# EAGLE design optoshield-low1 (EAGLE 6.6.0)
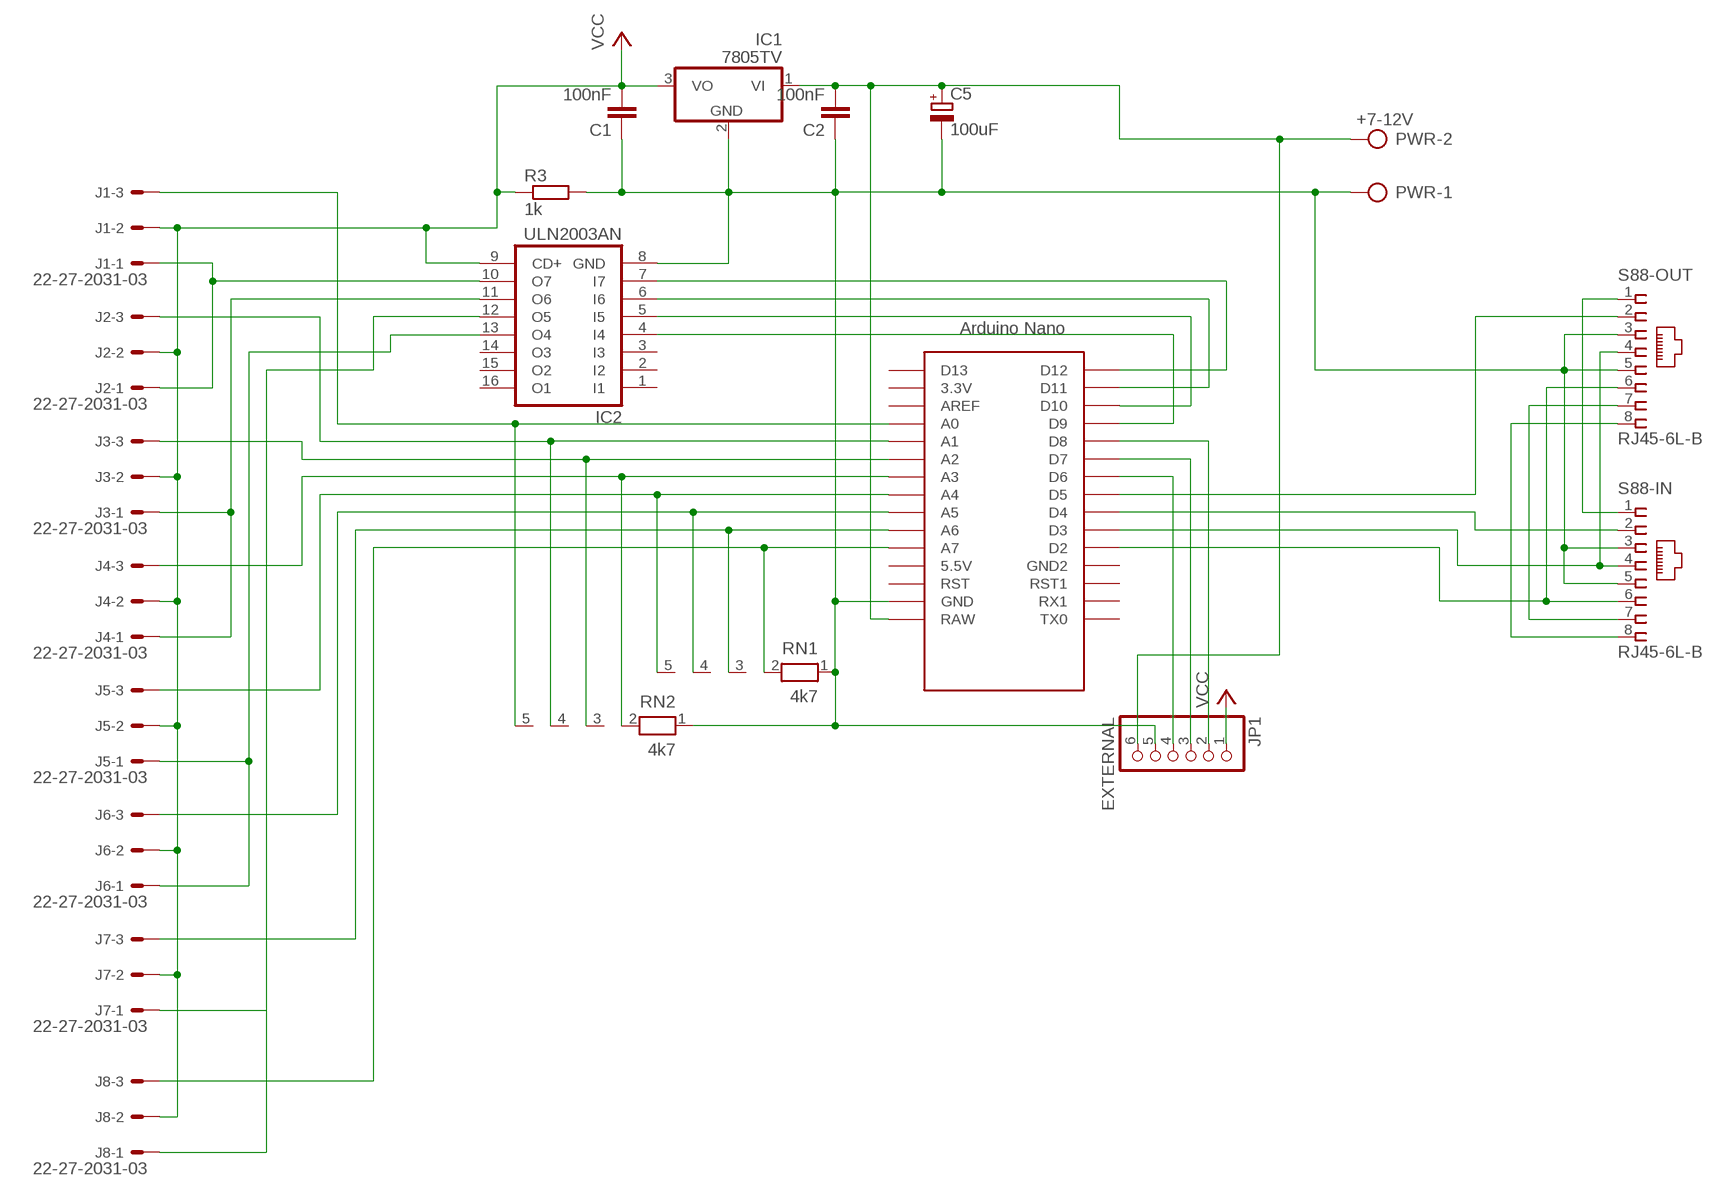
[diagram p0: schematic, sheet 1]

## Parts
C1  100nF  C-EU025-025X050  [C025-025X050]
C2  100nF  C-EU025-025X050  [C025-025X050]
C5  100uF  CPOL-EUE3.5-10  [E3,5-10]
IC1  7805TV  [TO220V]
IC2  ULN2003AN  [DIL16]
J1  22-27-2031-03  [6410-03]
J2  22-27-2031-03  [6410-03]
J3  22-27-2031-03  [6410-03]
J4  22-27-2031-03  [6410-03]
J5  22-27-2031-03  [6410-03]
J6  22-27-2031-03  [6410-03]
J7  22-27-2031-03  [6410-03]
J8  22-27-2031-03  [6410-03]
JP1  EXTERNAL  PINHD-1X6  [1X06]
PWR  +7-12V  AK500/2  [AK500/2]
R3  1k  R-EU_0207/10  [0207/10]
RN1  4k7  RN04  [RN-5]
RN2  4k7  RN04  [RN-5]
S88-IN  RJ45-6L-B  [RJ45-NO-SHIELD]
S88-OUT  RJ45-6L-B  [RJ45-NO-SHIELD]
U$1  NANO  [NANO]

## Nets
GND: C1.1 C2.1 C5.- IC1.2(GND) IC2.8(GND) JP1.5 PWR.1 R3.2 RN1.1 RN2.1 S88-IN.3 S88-IN.5 S88-OUT.3 S88-OUT.5 U$1.GND
N$1: C2.2 C5.+ IC1.1(VI) JP1.6 PWR.2 U$1.RAW
N$2: S88-IN.1 S88-OUT.1
N$3: JP1.2 U$1.D8
N$5: J1.3 RN2.5 U$1.A0
N$6: J4.3 RN2.2 U$1.A3
N$7: J5.3 RN1.5 U$1.A4
N$8: J2.3 RN2.4 U$1.A1
N$9: J3.3 RN2.3 U$1.A2
N$10: J6.3 RN1.4 U$1.A5
N$11: J7.3 RN1.3 U$1.A6
N$12: J8.3 RN1.2 U$1.A7
N$13: JP1.3 U$1.D7
N$14: S88-IN.8 S88-OUT.8
N$15: S88-IN.6 S88-OUT.6 U$1.D2
N$16: IC2.7(I7) U$1.D12
N$17: S88-IN.7 S88-OUT.7
N$18: S88-IN.4 S88-OUT.4 U$1.D3
N$19: S88-IN.2 U$1.D4
N$20: IC2.12(O5) J7.1 J8.1
N$21: S88-OUT.2 U$1.D5
N$23: IC2.6(I6) U$1.D11
N$24: IC2.5(I5) U$1.D10
N$25: IC2.4(I4) U$1.D9
N$26: JP1.4 U$1.D6
N$29: IC2.10(O7) J1.1 J2.1
N$30: IC2.11(O6) J3.1 J4.1
N$32: IC2.13(O4) J5.1 J6.1
VCC: C1.2 IC1.3(VO) IC2.9(CD+) J1.2 J2.2 J3.2 J4.2 J5.2 J6.2 J7.2 J8.2 JP1.1 R3.1
Unconnected: IC2.1(I1) IC2.2(I2) IC2.3(I3) IC2.14(O3) IC2.15(O2) IC2.16(O1) U$1.3.3V U$1.5V(5.5V) U$1.AREF U$1.D13 U$1.GND1(GND2) U$1.ICSP1 U$1.ICSP2 U$1.ICSP3 U$1.ICSP4 U$1.ICSP5 U$1.ICSP6 U$1.RST U$1.RST1 U$1.RX1 U$1.TX0

## Library data of the parts
C1 C2 = rcl:C-EU: CAPACITOR, European symbol
C5 = resistor:CPOL-EU: POLARIZED CAPACITOR, European symbol
IC1 = linear:78*: Positive VOLTAGE REGULATOR Source: http://cache.national.com/ds/LM/LM78L05.pdf http://www.fairchildsemi.com/ds/LM/LM7805.pdf
IC2 = uln-udn:ULN2003A: DRIVER ARRAY
J1-J8 = con-molex:22-?-03: CONNECTOR wire to board 2.54 mm (.1 inch) pitch header; OC_FARNELL: unknown; OC_NEWARK: unknown
JP1 = pinhead:PINHD-1X6: PIN HEADER
PWR = con-ptr500:AK500/2: CONNECTOR; OC_FARNELL: unknown; OC_NEWARK: unknown
R3 = resistor:R-EU_: RESISTOR, European symbol
RN1 RN2 = resistor-net:RN04: RESISTOR NETWORK; OC_FARNELL: unknown; OC_NEWARK: unknown
S88-IN S88-OUT = con-tycoelectronics:RJ45: CORCOM Modular RJ Jacks No Shield Source: www.tycoelectronics.com .. ENG_DS_1654001_1099_RJ_L_0507.pdf; MPN: RJ45-6L-B; OC_FARNELL: unknown; OC_NEWARK: 16R6090
U$1 = Arduino-clone:NANO: Arduino Nano

## Board
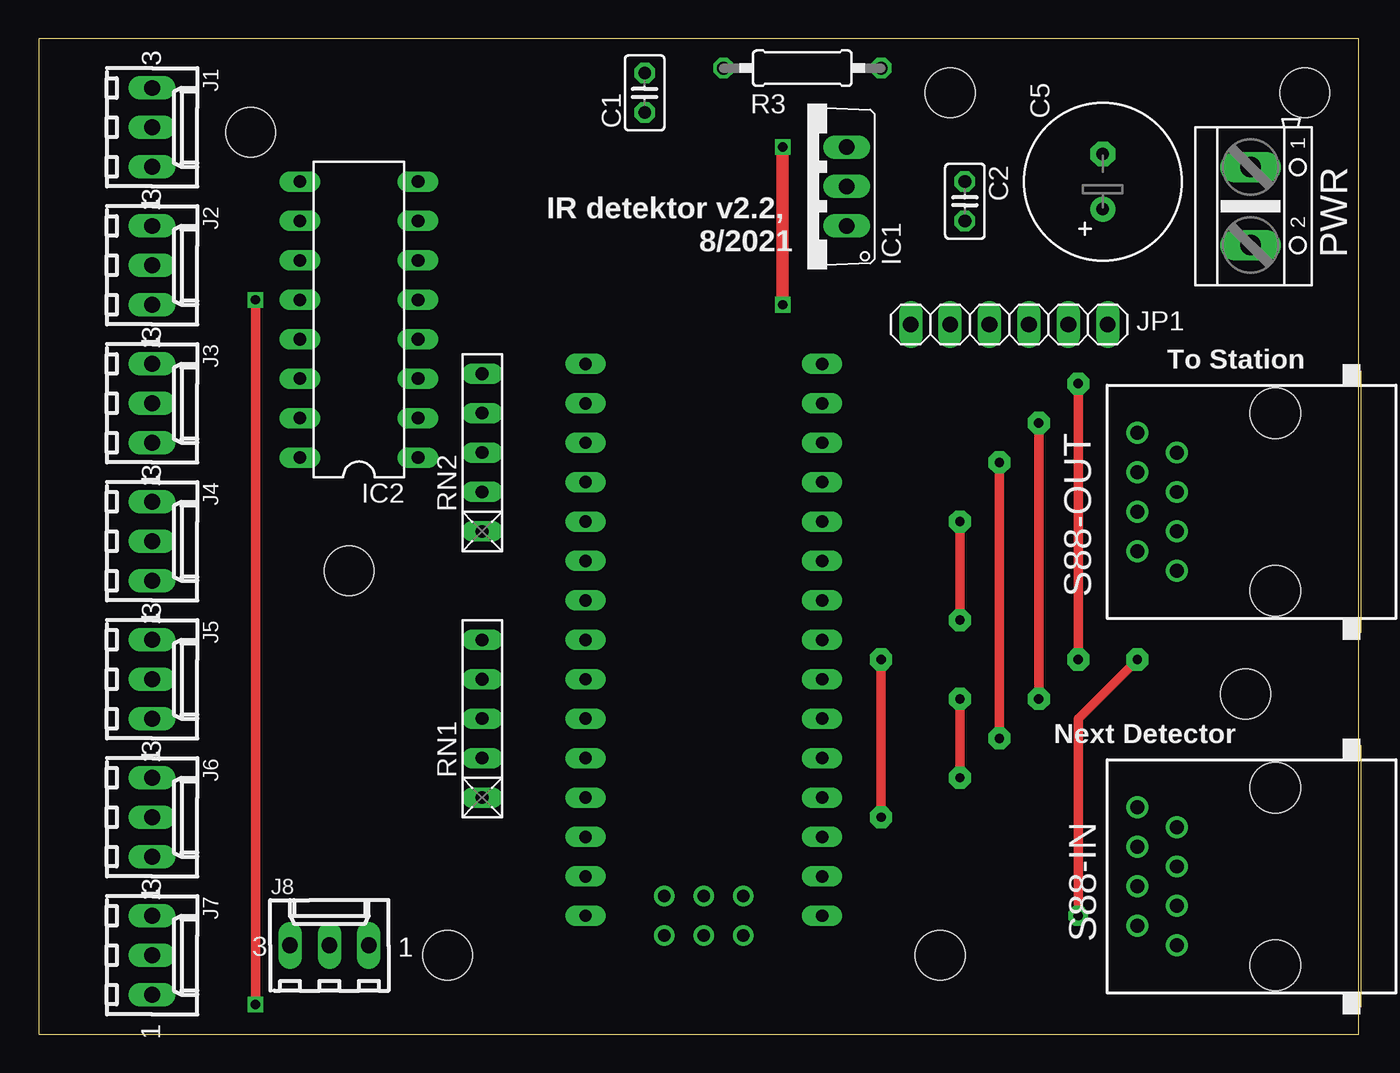
[diagram p1: board, top side]
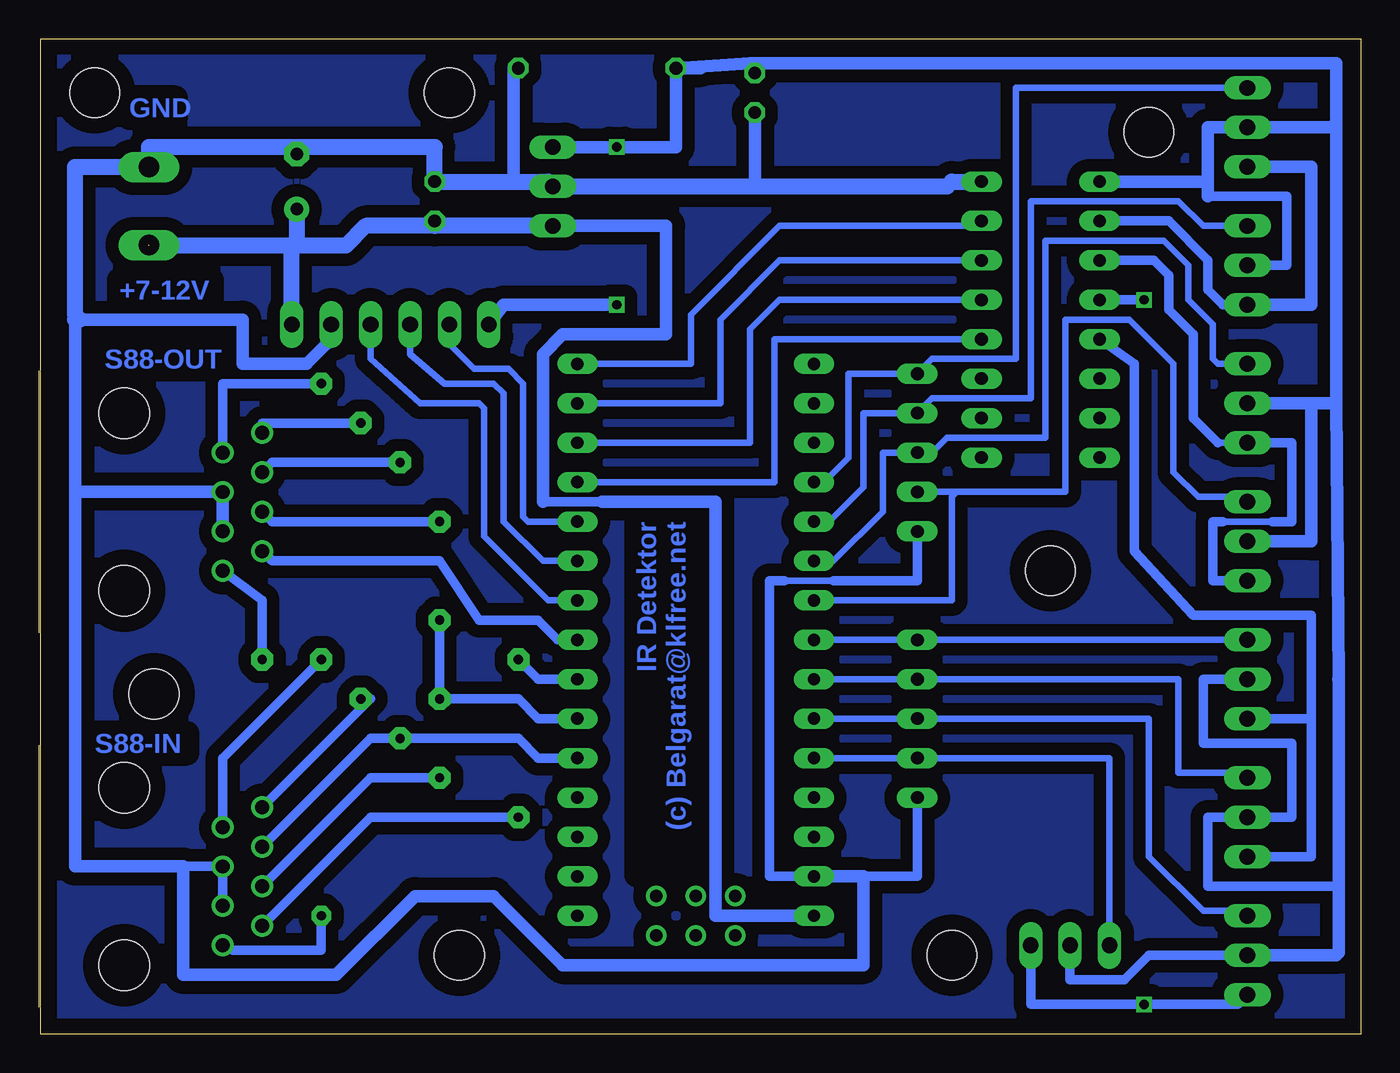
[diagram p2: board, bottom side, seen from below]

Size 85.08 x 64.12 mm. Coordinates in mm from the lower left corner, seen from the top.
Outline: 0,0 85.08,0 85.08,64.12 0,64.12 0,0
Copper layers (1*16): Top 0.035mm / dielectric 1.5mm / Bottom 0.035mm
Design rules "default *": minimum track width 10mil, minimum drill 0.6mm, track to track 8mil, track to pad 8mil, pad to pad 8mil, via to via 8mil, smd to smd 8mil, copper to edge 40mil, drill to drill 8mil, minimum pad ring 10mil, minimum via ring 8mil, stop-mask expansion 4mil, vias tented up to drill 0mil, thermal gap 10mil
Holes 3.2 mm at 77.79,21.91 81.6,60.64 58.1,5.08 58.74,60.64 13.65,58.1 26.35,5.08 20,29.84

### Footprints (pad centres in the part's own frame; a part is rotated, then mirrored left to right if it is on the bottom)
C025-025X050 = drill 0.813 octagon: 1 -1.27,0; 2 1.27,0
E3,5-10 = drill 0.813 pad 1.6: + -1.778,0 | drill 0.813 pad 1.6 octagon: - 1.778,0
TO220V = drill 1.016 long: 1 -2.54,-2.54; 2 0,-2.54; 3 2.54,-2.54
DIL16 = drill 0.813 long: 1 -8.89,-3.81; 2 -6.35,-3.81; 3 -3.81,-3.81; 4 -1.27,-3.81; 5 1.27,-3.81; 6 3.81,-3.81; 7 6.35,-3.81; 8 8.89,-3.81; 9 8.89,3.81; 10 6.35,3.81; 11 3.81,3.81; 12 1.27,3.81; 13 -1.27,3.81; 14 -3.81,3.81; 15 -6.35,3.81; 16 -8.89,3.81
6410-03 = drill 1.016 long: 1 2.54,0; 2 0,0; 3 -2.54,0
1X06 = drill 1.016 long: 1 -6.35,0; 2 -3.81,0; 3 -1.27,0; 4 1.27,0; 5 3.81,0; 6 6.35,0
AK500/2 = drill 1.321 long: 1 -2.515,0; 2 2.515,0
0207/10 = drill 0.813 octagon: 1 -5.08,0; 2 5.08,0
RN-5 = drill 0.813 long: 1 -5.08,0; 2 -2.54,0; 3 0,0; 4 2.54,0; 5 5.08,0
RJ45-NO-SHIELD = drill 0.9 pad 1.4: 1 -4.445,6.35; 2 -3.175,8.89; 3 -1.905,6.35; 4 -0.635,8.89; 5 0.635,6.35; 6 1.905,8.89; 7 3.175,6.35; 8 4.445,8.89 | hole 3.251: -5.715,0; 5.715,0
NANO = drill 0.8 long: 3.3V -10.16,24.13; 5V -10.16,-1.27; A0 -10.16,19.05; A1 -10.16,16.51; A2 -10.16,13.97; A3 -10.16,11.43; A4 -10.16,8.89; A5 -10.16,6.35; A6 -10.16,3.81; A7 -10.16,1.27; AREF -10.16,21.59; D2 5.08,1.27; D3 5.08,3.81; D4 5.08,6.35; D5 5.08,8.89; D6 5.08,11.43; D7 5.08,13.97; D8 5.08,16.51; D9 5.08,19.05; D10 5.08,21.59; D11 5.08,24.13; D12 5.08,26.67; D13 -10.16,26.67; GND -10.16,-6.35; GND1 5.08,-1.27; RAW -10.16,-8.89; RST -10.16,-3.81; RST1 5.08,-3.81; RX1 5.08,-6.35; TX0 5.08,-8.89 | drill 0.8: ICSP1 -5.08,-10.16; ICSP2 -5.08,-7.62; ICSP3 -2.54,-10.16; ICSP4 -2.54,-7.62; ICSP5 0,-10.16; ICSP6 0,-7.62

### Placement (x,y rotation side)
C1  39.05,60.64 90 top
C2  59.69,53.66 270 top
C5  68.58,54.93 90 top
IC1  49.53,54.61 90 top
IC2  20.64,46.04 90 top
J1  7.3,58.42 270 top
J2  7.3,49.53 270 top
J3  7.3,40.64 270 top
J4  7.3,31.75 270 top
J5  7.3,22.86 270 top
J6  7.3,13.97 270 top
J7  7.3,5.08 270 top
J8  18.73,5.71 0 top
JP1  62.55,45.72 0 top
PWR  78.1,53.34 270 top
R3  49.21,62.23 0 top
RN1  28.57,20.32 90 top
RN2  28.57,37.46 90 top
S88-IN  79.69,10.16 90 top
S88-OUT  79.69,34.29 90 top
U$1  45.4,16.51 0 top

### Tracks (layer width: path | path; a pad name or v marks a point on that pad's centre or on a via)
GND
  Bottom 0.406: 37.15,29.21 33.97,29.21
  Bottom 0.61: S88-IN.3 S88-IN.5 75.88,10.79 | RN1.1 28.58,10.16 32.07,10.16 | U$1.GND 38.1,10.16 38.1,29.21 37.15,29.21 | 33.97,29.21 28.58,29.21 RN2.1 | 82.87,46.04 82.87,46.35
  Bottom 0.813: U$1.GND 32.07,10.16 32.07,4.45 51.43,4.45 55.88,8.89 60.96,8.89 66.04,3.81 75.88,3.81 75.88,10.79 82.87,10.79 82.87,34.92 | C1.1 39.05,54.93 38.73,54.61 | R3.2 54.61,62.23 54.61,54.93 | 82.87,34.92 82.87,45.72 82.55,46.04 72.07,46.04 72.07,43.18 67.94,43.18 66.67,44.45 JP1.5 | 82.87,34.92 S88-OUT.5 S88-OUT.3
  Bottom 1.016: 68.58,57.15 59.69,57.15 C2.1 54.61,54.93 52.39,54.93 IC1.2 38.73,54.61 26.67,54.61 26.35,54.93 IC2.8 | 68.58,57.15 78.11,57.15 78.11,55.88 | 82.87,46.35 82.87,55.88 78.11,55.88 | 78.11,55.88 PWR.1 | C5.- 68.58,57.15 | 82.55,46.04 82.87,46.04
N16
  pour Bottom (isolate 0.813): 0.63,63.5 84.14,63.5 83.82,0.64 0.32,0.64
N$1  (1 unrouted)
  Bottom 0.61: 48.9,34.29 52.39,34.29 52.7,34.61
  Bottom 0.813: U$1.RAW 41.59,7.62 41.59,34.29 48.9,34.29 | 52.7,34.29 52.7,34.61 52.7,43.81 51.43,45.09 44.77,45.09 44.77,52.07 IC1.1
  Bottom 1.016: 68.58,50.8 65.4,50.8 64.14,52.07 59.69,52.07 | 68.58,50.8 69.22,50.8 | 69.22,50.8 78.08,50.8 | C5.+ 68.58,50.8 | IC1.1 59.69,52.07 | C2.2 59.69,52.07 | JP1.6 68.9,50.48 69.22,50.8
N$2  (via drill 0.6 pad 1.27, 0.6 pad 1.42)
  Top 0.61: v70.8,24.13 66.99,20.32 v66.99,7.62
  Bottom 0.61: S88-IN.1 72.71,5.4 66.99,5.4 v66.99,7.62 | S88-OUT.1 70.8,27.94 v70.8,24.13
N$3
  Bottom 0.406: U$1.D8 53.66,33.02 53.97,33.34 53.97,41.91 54.93,42.86 57.15,42.86 58.74,44.45 JP1.2
N$5
  Bottom 0.406: J1.3 22.22,60.96 22.22,43.5 27.62,43.5 RN2.5 33.02,42.55 33.02,37.15 34.61,35.56 U$1.A0
N$6
  Bottom 0.406: RN2.2 26.04,34.92 | 26.04,34.92 19.05,34.92 19.05,46.04 14.92,46.04 12.06,43.18 12.06,36.2 10.48,34.61 7.62,34.61 J4.3 | U$1.A3 26.35,27.94 26.35,34.61 26.04,34.92
N$7
  Bottom 0.406: J5.3 RN1.5 U$1.A4
N$8
  Bottom 0.406: J2.3 10.16,52.07 11.75,53.66 21.27,53.66 21.27,40.96 27.62,40.96 RN2.4 32.07,40 32.07,35.24 34.29,33.02 U$1.A1
N$9
  Bottom 0.406: J3.3 9.21,43.18 9.52,43.5 9.52,45.72 11.11,47.31 11.11,49.53 12.7,51.12 20.32,51.12 20.32,38.42 26.67,38.42 27.62,37.46 RN2.3 30.8,37.46 30.8,33.66 33.97,30.48 U$1.A2
N$10
  Bottom 0.406: J6.3 7.62,16.83 11.75,16.83 11.75,22.86 RN1.4 U$1.A5
N$11
  Bottom 0.406: J7.3 7.62,7.94 10.16,7.94 13.65,11.43 13.65,20.32 RN1.3 U$1.A6
N$12
  Bottom 0.406: J8.3 16.19,17.78 RN1.2 U$1.A7
N$13
  Bottom 0.406: JP1.3 61.28,43.81 59.05,41.91 55.88,41.91 55.24,41.27 55.24,33.02 52.7,30.48 U$1.D7
N$14  (via drill 0.6 pad 1.42)
  Top 0.61: v64.45,39.37 v64.45,21.59
  Bottom 0.61: S88-IN.8 63.82,21.59 v64.45,21.59 | v64.45,39.37 70.8,39.37 S88-OUT.8
N$15  (via drill 0.6 pad 1.42)
  Top 0.61: v61.91,19.05 v61.91,36.83
  Bottom 0.61: S88-IN.6 63.82,19.05 v61.91,19.05 54.29,19.05 53.02,17.78 U$1.D2 | S88-OUT.6 70.17,36.83 v61.91,36.83
N$16
  Bottom 0.406: U$1.D12 43.18,43.18 43.18,46.35 37.47,52.07 25.4,52.07 25.08,52.39 IC2.7
N$17  (via drill 0.6 pad 1.42)
  Top 0.61: v66.99,41.91 v66.99,24.13
  Bottom 0.61: S88-IN.7 73.34,17.78 v66.99,24.13 | S88-OUT.7 73.34,41.91 v66.99,41.91
N$18  (via drill 0.6 pad 1.42)
  Top 0.61: v59.37,16.51 v59.37,21.59 | v59.37,26.67 v59.37,33.02
  Bottom 0.61: S88-IN.4 63.82,16.51 v59.37,16.51 | S88-OUT.4 70.17,33.02 v59.37,33.02 | U$1.D3 53.02,20.32 54.29,21.59 v59.37,21.59 v59.37,26.67
N$19  (via drill 0.6 pad 1.42)
  Top 0.61: v54.29,24.13 v54.29,13.97
  Bottom 0.61: S88-IN.2 63.82,13.97 v54.29,13.97 | U$1.D4 53.02,22.86 v54.29,24.13
N$20  (via drill 0.6)
  Top 0.61: v13.97,47.31 v13.97,1.91
  Bottom 0.61: J7.1 7.94,1.91 v13.97,1.91 21.27,1.91 J8.1 | IC2.12 v13.97,47.31
N$21
  Bottom 0.61: S88-OUT.2 70.17,30.48 59.37,30.48 56.83,26.67 53.02,26.67 51.75,25.4 U$1.D5
N$23
  Bottom 0.406: U$1.D11 41.27,40.64 41.27,46.04 37.47,49.85 IC2.6
N$24
  Bottom 0.406: U$1.D10 39.37,38.1 39.37,45.4 37.47,47.31 25.4,47.31 25.08,46.99 24.76,46.99 IC2.5
N$25
  Bottom 0.406: U$1.D9 37.78,35.56 37.78,44.77 IC2.4
N$26
  Bottom 0.406: U$1.D6 52.39,27.94 56.51,32.07 56.51,40.32 56.83,40.64 60.64,40.64 63.82,43.5 JP1.4
N$29
  Bottom 0.61: IC2.10 12.38,52.39 9.84,49.85 9.84,47.94 8.89,46.99 J2.1
  Bottom 0.813: J1.1 3.17,55.88 3.17,46.99 J2.1
N$30
  Bottom 0.406: 9.21,38.1 J3.1 6.98,37.78 | 5.71,33.02 8.89,33.02
  Bottom 0.61: J3.1 4.44,38.1 4.44,33.02 5.71,33.02 | J4.1 9.52,29.21 9.52,33.02 8.89,33.02 | IC2.11 13.33,49.85 12.38,48.89 12.38,46.67 10.79,45.09 10.79,39.69 9.21,38.1
N$32
  Bottom 0.61: IC2.13 14.61,43.18 14.61,31.12 10.79,26.99 3.17,26.99 3.17,20.32 | 3.17,20.32 J5.1 | 3.17,20.32 3.17,11.43 J6.1
VCC  (via drill 0.6)
  Top 0.813: v47.94,57.15 v47.94,46.99
  Bottom 0.61: 9.84,53.98 4.76,53.98 4.76,49.53 J2.2 | J5.2 10.16,22.86 10.16,18.73 4.44,18.73 4.44,13.97 J6.2 9.84,13.97 9.84,9.53 1.43,9.53 | 7.94,5.08 13.65,5.08 15.24,3.49 18.73,3.49 J8.2
  Bottom 0.813: 9.84,54.93 9.84,58.42 J1.2 1.9,58.42 1.59,58.74 | R3.1 39.37,62.55 | 39.37,62.55 1.59,62.55 1.59,58.74 | 1.59,58.74 1.59,40.64 | 1.59,40.64 1.43,22.86 | 1.43,22.86 | 1.43,22.86 1.43,9.53 1.43,5.24 1.59,5.08 J7.2 | IC2.9 9.84,54.93 | 9.84,54.93 9.84,53.98 | J3.2 3.17,40.64 | 3.17,40.64 3.17,31.75 J4.2 | IC1.3 v47.94,57.15 44.13,57.15 R3.1 | R3.1 42.54,62.23 | C1.2 39.37,62.55 | v47.94,46.99 55.24,46.99 JP1.1 | 3.17,40.64 1.59,40.64
  Bottom 1.016: 7.94,5.08 J7.2 | J3.2 7.62,40.64

### Text on the board
Bottom: GND | +7-12V | S88-OUT | IR Detektor / (c) Belgarat@klfree.net | S88-IN
tPlace: IR detektor v2.2, / 8/2021
tNames: To Station | Next Detector
tValues: 5V-OUT 3x-GND,PWR